# Altium project 2013_fdp_banc_de_test.PrjPcb
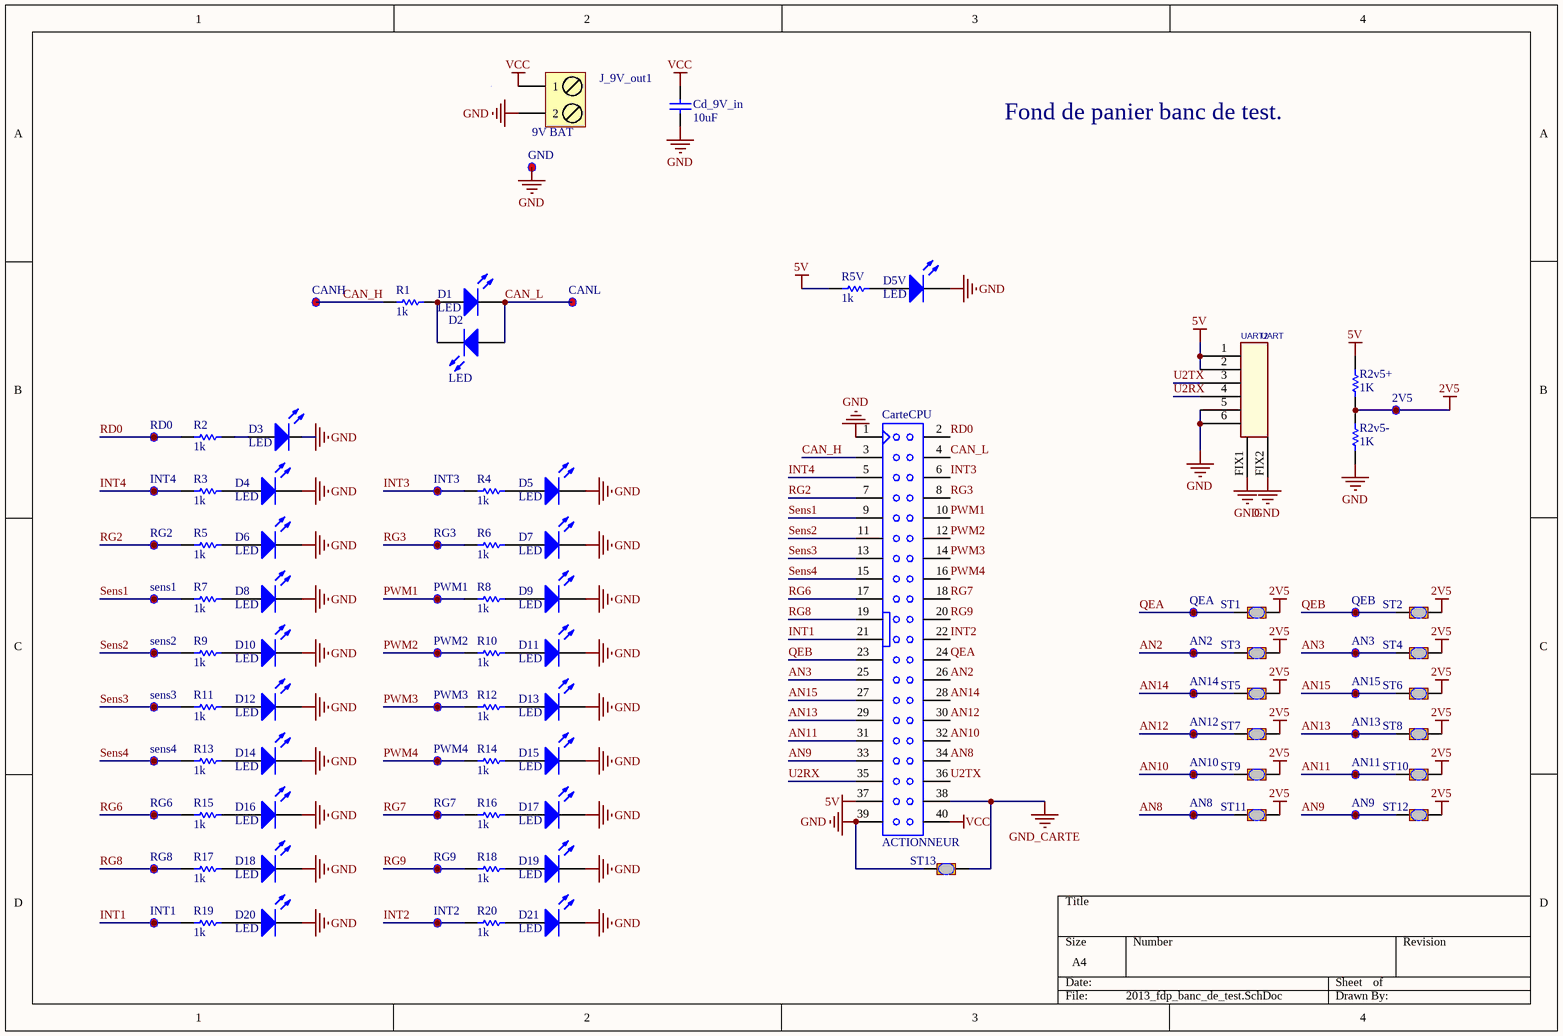
[diagram p0: 2013_fdp_banc_de_test.SchDoc]
1 sheet, 97 parts. Net scope: global (net labels, ports and power ports of the same name join across sheets).
Board file: 2013_fdp_banc_de_test.PcbDoc

## Sheet 2013_fdp_banc_de_test.SchDoc
size A4

### Parts
2V5  Name  [Point Test_D0.9_P0.5mm]  (value not drawn)
AN2  Name  [Point Test_D0.9_P0.5mm]  (value not drawn)
AN3  Name  [Point Test_D0.9_P0.5mm]  (value not drawn)
AN8  Name  [Point Test_D0.9_P0.5mm]  (value not drawn)
AN9  Name  [Point Test_D0.9_P0.5mm]  (value not drawn)
AN10  Name  [Point Test_D0.9_P0.5mm]  (value not drawn)
AN11  Name  [Point Test_D0.9_P0.5mm]  (value not drawn)
AN12  Name  [Point Test_D0.9_P0.5mm]  (value not drawn)
AN13  Name  [Point Test_D0.9_P0.5mm]  (value not drawn)
AN14  Name  [Point Test_D0.9_P0.5mm]  (value not drawn)
AN15  Name  [Point Test_D0.9_P0.5mm]  (value not drawn)
CANH  Name  [Point Test_D0.9_P0.5mm]  (value not drawn)
CANL  Name  [Point Test_D0.9_P0.5mm]  (value not drawn)
CarteCPU  ACTIONNEUR  [HE10/40_MAL_DROIT-FDP-ROBOT]
Cd_9V_in  10uF  [C0805_N]
D1  LED  [LED_0805]
D2  LED  [LED_0805]
D3  LED  [LED_0805]
D4  LED  [LED_0805]
D5  LED  [LED_0805]
D5V  LED  [LED_0805]
D6  LED  [LED_0805]
D7  LED  [LED_0805]
D8  LED  [LED_0805]
D9  LED  [LED_0805]
D10  LED  [LED_0805]
D11  LED  [LED_0805]
D12  LED  [LED_0805]
D13  LED  [LED_0805]
D14  LED  [LED_0805]
D15  LED  [LED_0805]
D16  LED  [LED_0805]
D17  LED  [LED_0805]
D18  LED  [LED_0805]
D19  LED  [LED_0805]
D20  LED  [LED_0805]
D21  LED  [LED_0805]
GND  Name  [Point Test_D0.9_P0.5mm]  (value not drawn)
INT1  Name  [Point Test_D0.9_P0.5mm]  (value not drawn)
INT2  Name  [Point Test_D0.9_P0.5mm]  (value not drawn)
INT3  Name  [Point Test_D0.9_P0.5mm]  (value not drawn)
INT4  Name  [Point Test_D0.9_P0.5mm]  (value not drawn)
J_9V_out1  9V BAT  [BORNIER2]
PWM1  Name  [Point Test_D0.9_P0.5mm]  (value not drawn)
PWM2  Name  [Point Test_D0.9_P0.5mm]  (value not drawn)
PWM3  Name  [Point Test_D0.9_P0.5mm]  (value not drawn)
PWM4  Name  [Point Test_D0.9_P0.5mm]  (value not drawn)
QEA  Name  [Point Test_D0.9_P0.5mm]  (value not drawn)
QEB  Name  [Point Test_D0.9_P0.5mm]  (value not drawn)
R1  1k  [R1206_N]
R2  1k  [R1206_N]
R2v5+  1K  [R1206_N]
R2v5-  1K  [R1206_N]
R3  1k  [R1206_N]
R4  1k  [R1206_N]
R5  1k  [R1206_N]
R5V  1k  [R1206_N]
R6  1k  [R1206_N]
R7  1k  [R1206_N]
R8  1k  [R1206_N]
R9  1k  [R1206_N]
R10  1k  [R1206_N]
R11  1k  [R1206_N]
R12  1k  [R1206_N]
R13  1k  [R1206_N]
R14  1k  [R1206_N]
R15  1k  [R1206_N]
R16  1k  [R1206_N]
R17  1k  [R1206_N]
R18  1k  [R1206_N]
R19  1k  [R1206_N]
R20  1k  [R1206_N]
RD0  Name  [Point Test_D0.9_P0.5mm]  (value not drawn)
RG2  Name  [Point Test_D0.9_P0.5mm]  (value not drawn)
RG3  Name  [Point Test_D0.9_P0.5mm]  (value not drawn)
RG6  Name  [Point Test_D0.9_P0.5mm]  (value not drawn)
RG7  Name  [Point Test_D0.9_P0.5mm]  (value not drawn)
RG8  Name  [Point Test_D0.9_P0.5mm]  (value not drawn)
RG9  Name  [Point Test_D0.9_P0.5mm]  (value not drawn)
sens1  Name  [Point Test_D0.9_P0.5mm]  (value not drawn)
sens2  Name  [Point Test_D0.9_P0.5mm]  (value not drawn)
sens3  Name  [Point Test_D0.9_P0.5mm]  (value not drawn)
sens4  Name  [Point Test_D0.9_P0.5mm]  (value not drawn)
ST1  Goutte Strap_2  [Goutte Strap_2 Pads_Clearance 0.254mm]  (value not drawn)
ST2  Goutte Strap_2  [Goutte Strap_2 Pads_Clearance 0.254mm]  (value not drawn)
ST3  Goutte Strap_2  [Goutte Strap_2 Pads_Clearance 0.254mm]  (value not drawn)
ST4  Goutte Strap_2  [Goutte Strap_2 Pads_Clearance 0.254mm]  (value not drawn)
ST5  Goutte Strap_2  [Goutte Strap_2 Pads_Clearance 0.254mm]  (value not drawn)
ST6  Goutte Strap_2  [Goutte Strap_2 Pads_Clearance 0.254mm]  (value not drawn)
ST7  Goutte Strap_2  [Goutte Strap_2 Pads_Clearance 0.254mm]  (value not drawn)
ST8  Goutte Strap_2  [Goutte Strap_2 Pads_Clearance 0.254mm]  (value not drawn)
ST9  Goutte Strap_2  [Goutte Strap_2 Pads_Clearance 0.254mm]  (value not drawn)
ST10  Goutte Strap_2  [Goutte Strap_2 Pads_Clearance 0.254mm]  (value not drawn)
ST11  Goutte Strap_2  [Goutte Strap_2 Pads_Clearance 0.254mm]  (value not drawn)
ST12  Goutte Strap_2  [Goutte Strap_2 Pads_Clearance 0.254mm]  (value not drawn)
ST13  Goutte Strap_2  [Goutte Strap_2 Pads_Clearance 0.254mm]  (value not drawn)
UART2  UART  [RJ11_6/6]

### Nets
2V5: 2V5.1 R2v5+.1 R2v5-.2 ST1.2 ST2.2 ST3.2 ST4.2 ST5.2 ST6.2 ST7.2 ST8.2 ST9.2 ST10.2 ST11.2 ST12.2
5V: CarteCPU.37 R2v5+.2 R5V.1 UART2.1 UART2.2
GND: CarteCPU.1 CarteCPU.39 Cd_9V_in.1 D3.2(K) D4.2(K) D5.2(K) D5V.2(K) D6.2(K) D7.2(K) D8.2(K) D9.2(K) D10.2(K) D11.2(K) D12.2(K) D13.2(K) D14.2(K) D15.2(K) D16.2(K) D17.2(K) D18.2(K) D19.2(K) D20.2(K) D21.2(K) GND.1 J_9V_out1.2 R2v5-.1 ST13.1 UART2.5 UART2.6 UART2.FIX1 UART2.FIX2
GND_CARTE: CarteCPU.38 ST13.2
VCC: CarteCPU.40 Cd_9V_in.2 J_9V_out1.1
AN2: AN2.1 CarteCPU.26 ST3.1
AN3: AN3.1 CarteCPU.25 ST4.1
AN8: AN8.1 CarteCPU.34 ST11.1
AN9: AN9.1 CarteCPU.33 ST12.1
AN10: AN10.1 CarteCPU.32 ST9.1
AN11: AN11.1 CarteCPU.31 ST10.1
AN12: AN12.1 CarteCPU.30 ST7.1
AN13: AN13.1 CarteCPU.29 ST8.1
AN14: AN14.1 CarteCPU.28 ST5.1
AN15: AN15.1 CarteCPU.27 ST6.1
CAN_H: CANH.1 CarteCPU.3 R1.1
CAN_L: CANL.1 CarteCPU.4 D1.2(K) D2.1(A)
INT1: CarteCPU.21 INT1.1 R19.1
INT2: CarteCPU.22 INT2.1 R20.1
INT3: CarteCPU.6 INT3.1 R4.1
INT4: CarteCPU.5 INT4.1 R3.1
PWM1: CarteCPU.10 PWM1.1 R8.1
PWM2: CarteCPU.12 PWM2.1 R10.1
PWM3: CarteCPU.14 PWM3.1 R12.1
PWM4: CarteCPU.16 PWM4.1 R14.1
QEA: CarteCPU.24 QEA.1 ST1.1
QEB: CarteCPU.23 QEB.1 ST2.1
RD0: CarteCPU.2 R2.1 RD0.1
RG2: CarteCPU.7 R5.1 RG2.1
RG3: CarteCPU.8 R6.1 RG3.1
RG6: CarteCPU.17 R15.1 RG6.1
RG7: CarteCPU.18 R16.1 RG7.1
RG8: CarteCPU.19 R17.1 RG8.1
RG9: CarteCPU.20 R18.1 RG9.1
Sens1: CarteCPU.9 R7.1 sens1.1
Sens2: CarteCPU.11 R9.1 sens2.1
Sens3: CarteCPU.13 R11.1 sens3.1
Sens4: CarteCPU.15 R13.1 sens4.1
U2RX: CarteCPU.35 UART2.4
U2TX: CarteCPU.36 UART2.3
NetD1_1: D1.1(A) D2.2(K) R1.2
NetD3_1: D3.1(A) R2.2
NetD4_1: D4.1(A) R3.2
NetD5_1: D5.1(A) R4.2
NetD5V_1: D5V.1(A) R5V.2
NetD6_1: D6.1(A) R5.2
NetD7_1: D7.1(A) R6.2
NetD8_1: D8.1(A) R7.2
NetD9_1: D9.1(A) R8.2
NetD10_1: D10.1(A) R9.2
NetD11_1: D11.1(A) R10.2
NetD12_1: D12.1(A) R11.2
NetD13_1: D13.1(A) R12.2
NetD14_1: D14.1(A) R13.2
NetD15_1: D15.1(A) R14.2
NetD16_1: D16.1(A) R15.2
NetD17_1: D17.1(A) R16.2
NetD18_1: D18.1(A) R17.2
NetD19_1: D19.1(A) R18.2
NetD20_1: D20.1(A) R19.2
NetD21_1: D21.1(A) R20.2

### Notes on the sheet
- Fond de panier banc de test.

### Library data of the parts
2V5 AN2 AN3 AN8-AN15 CANH CANL GND INT1-INT4 PWM1-PWM4 QEA QEB RD0 RG2 RG3 RG6-RG9 sens1-sens4 = Point Test_2: Point test; Publisher: Damien GUITTON
CarteCPU = HE10/40: Connector; HE10; 40 Position; Male
Cd_9V_in = Condensateur: Capacitor; Published: 8-Jun-2000; LatestRevisionDate: 17-Jul-2002; LatestRevisionNote: Re-released for DXP Platform.; PackageReference: RAD-0.3; Publisher: Altium Limited
D1-D5 D5V D6-D21 = LED: Typical LED; Published: 8-Jun-2000; LatestRevisionDate: 08-Jul-2005; LatestRevisionNote: Mech Layer 1 removed.; PackageReference: LED-1; Publisher: Altium Limited
J_9V_out1 = BORNIER2: Terminal blocks, 2 pins, pitch=5mm
R1 R2 R2v5+ R2v5- R3-R5 R5V R6-R20 = Resistor: Published: 8-Jun-2000; LatestRevisionDate: 17-Jul-2002; LatestRevisionNote: Re-released for DXP Platform.; PackageReference: AXIAL-0.5; Publisher: Altium Limited
UART2 = CONNECTEUR_RJ12
ST1-ST13 = Goutte Strap_2: LatestRevisionDate: 30/01/11; Publisher: Damien Guitton